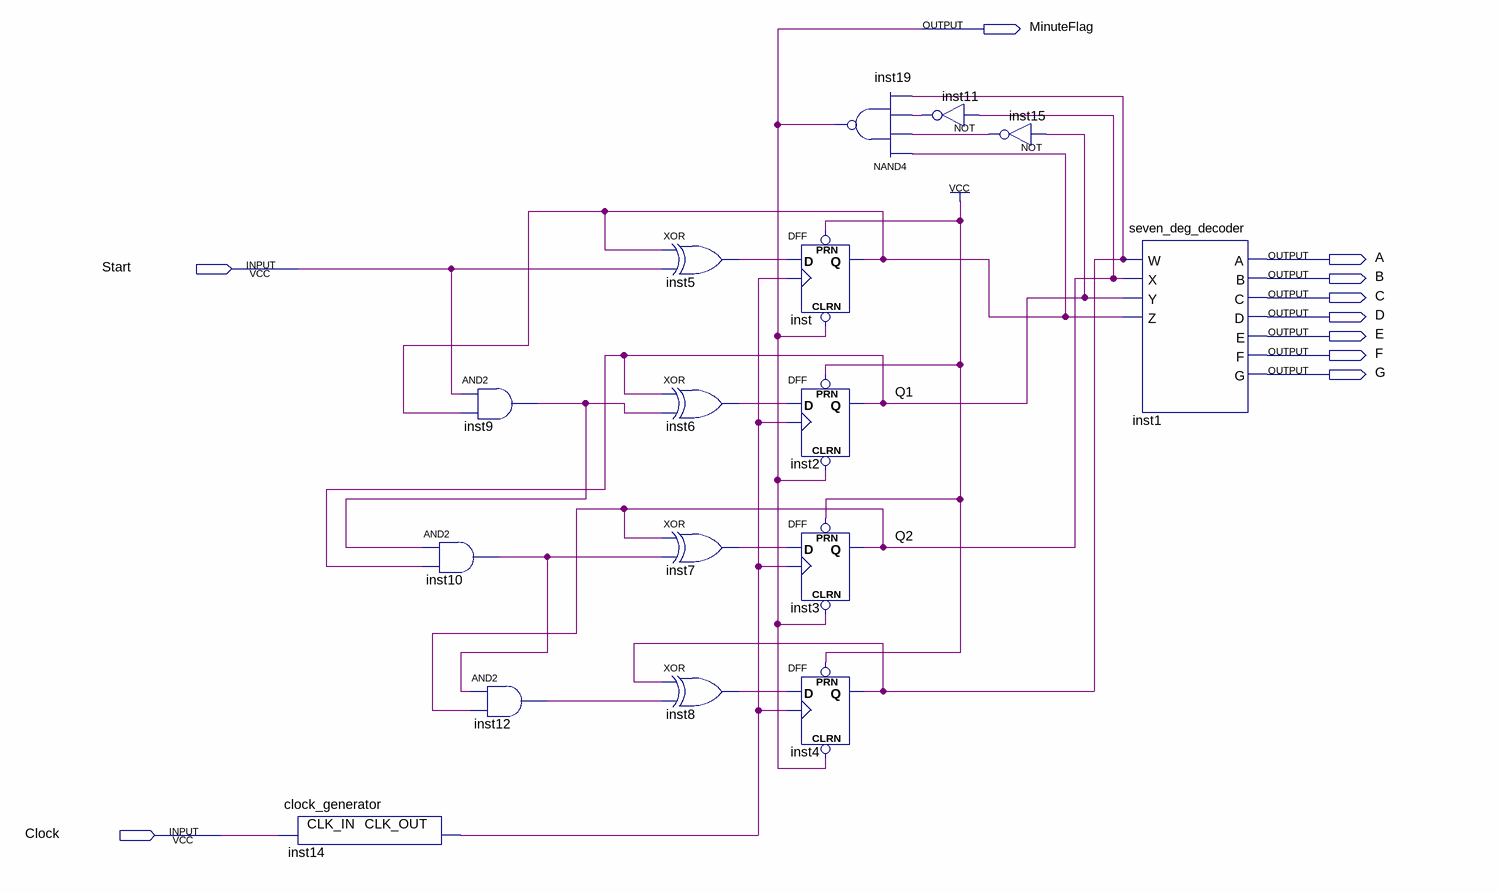
[diagram p0: schematic sheet]
// Quartus schematic FinProjStep3.bdf as structural Verilog: 16 symbols, 10 pins
module FinProjStep3 (
  input  Start,
  input  Clock,
  output MinuteFlag,
  output A,
  output B,
  output C,
  output D,
  output E,
  output F,
  output G
);

  wire inst4_q, inst5_out, inst6_out, inst7_out, inst8_out, inst9_out, inst10_out, inst11_out, inst12_out,
       inst14_clk_out, inst15_out, inst_q, Q1, Q2;

  clock_generator inst14 (.CLK_IN(Clock), .CLK_OUT(inst14_clk_out));
  and inst9 (inst9_out, Start, inst_q);
  and inst10 (inst10_out, inst9_out, Q1);
  and inst12 (inst12_out, inst10_out, Q2);
  xor inst5 (inst5_out, inst_q, Start);
  xor inst6 (inst6_out, Q1, inst9_out);
  xor inst7 (inst7_out, Q2, inst10_out);
  xor inst8 (inst8_out, inst4_q, inst12_out);
  DFF inst (.CLRN(MinuteFlag), .CLK(inst14_clk_out), .D(inst5_out), .PRN(1'b1), .Q(inst_q));
  DFF inst2 (.CLRN(MinuteFlag), .CLK(inst14_clk_out), .D(inst6_out), .PRN(1'b1), .Q(Q1));
  DFF inst3 (.CLRN(MinuteFlag), .CLK(inst14_clk_out), .D(inst7_out), .PRN(1'b1), .Q(Q2));
  DFF inst4 (.CLRN(MinuteFlag), .CLK(inst14_clk_out), .D(inst8_out), .PRN(1'b1), .Q(inst4_q));
  nand inst19 (MinuteFlag, inst_q, inst15_out, inst11_out, inst4_q);
  not inst11 (inst11_out, Q2);
  not inst15 (inst15_out, Q1);
  seven_deg_decoder inst1 (.W(inst4_q), .X(Q2), .Y(Q1), .Z(inst_q), .A(A), .B(B), .C(C), .D(D), .E(E), .F(F), .G(G));
endmodule
